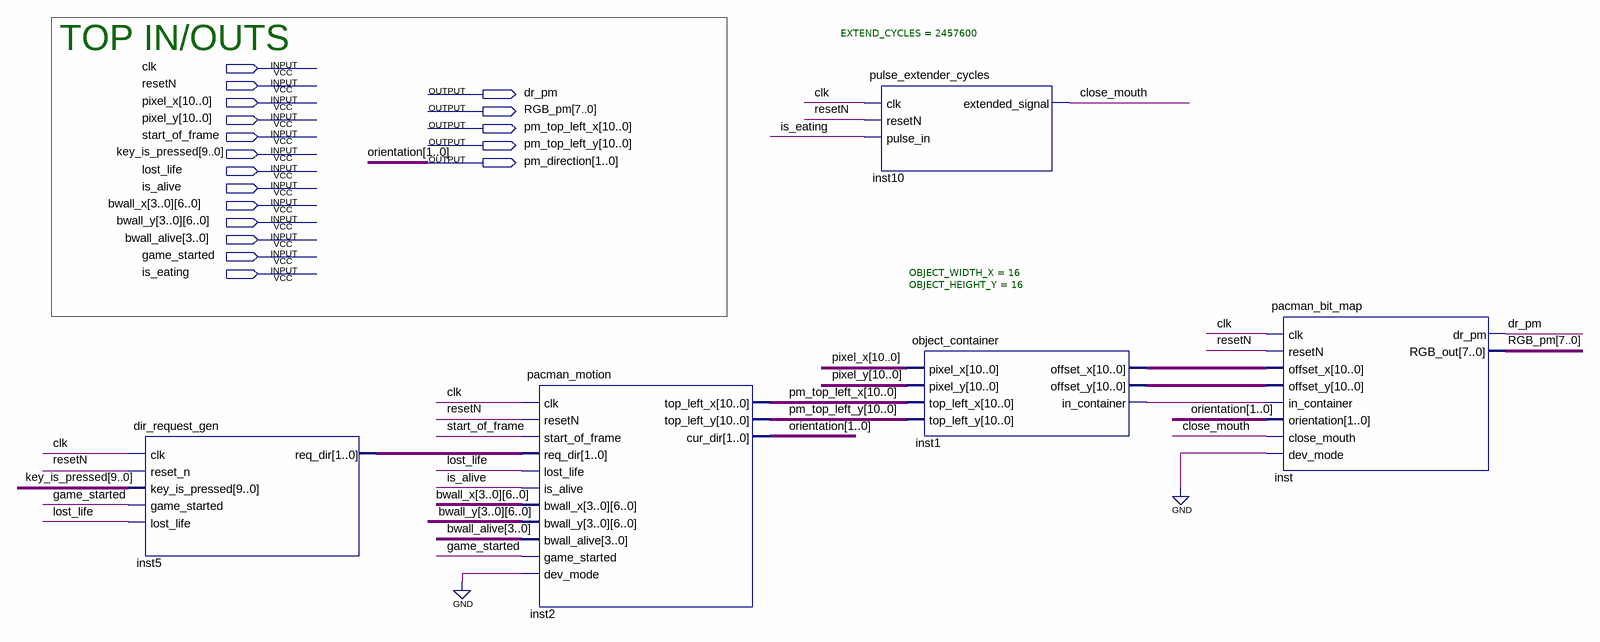
[diagram p0: schematic sheet]
// Quartus schematic TOP_PACMAN.bdf as structural Verilog: 5 symbols, 18 pins
module TOP_PACMAN (
  input  clk,
  input  resetN,
  input  [10:0] pixel_x,
  input  [10:0] pixel_y,
  input  start_of_frame,
  input  [9:0] key_is_pressed,
  input  lost_life,
  input  is_alive,
  input  [6:0] bwall_x_3,
  input  [6:0] bwall_x_2,
  input  [6:0] bwall_x_1,
  input  [6:0] bwall_x_0,
  input  [6:0] bwall_y_3,
  input  [6:0] bwall_y_2,
  input  [6:0] bwall_y_1,
  input  [6:0] bwall_y_0,
  input  [3:0] bwall_alive,
  input  game_started,
  input  is_eating,
  output dr_pm,
  output [7:0] RGB_pm,
  output [10:0] pm_top_left_x,
  output [10:0] pm_top_left_y,
  output [1:0] pm_direction
);

  wire close_mouth, inst1_in_container;
  wire [1:0] inst5_req_dir;
  wire [10:0] inst1_offset_x, inst1_offset_y;

  dir_request_gen inst5 (
    .clk(clk), .reset_n(resetN), .key_is_pressed(key_is_pressed), .game_started(game_started),
    .lost_life(lost_life), .req_dir(inst5_req_dir));
  pacman_motion inst2 (
    .clk(clk), .resetN(resetN), .start_of_frame(start_of_frame), .req_dir(inst5_req_dir),
    .lost_life(lost_life), .is_alive(is_alive), .bwall_x({bwall_x_3, bwall_x_2, bwall_x_1, bwall_x_0}),
    .bwall_y({bwall_y_3, bwall_y_2, bwall_y_1, bwall_y_0}), .bwall_alive(bwall_alive),
    .game_started(game_started), .dev_mode(1'b0), .top_left_x(pm_top_left_x), .top_left_y(pm_top_left_y),
    .cur_dir(pm_direction));
  pulse_extender_cycles #(.EXTEND_CYCLES(2457600)) inst10 (
    .clk(clk), .resetN(resetN), .pulse_in(is_eating), .extended_signal(close_mouth));
  object_container #(.OBJECT_WIDTH_X(16), .OBJECT_HEIGHT_Y(16)) inst1 (
    .pixel_x(pixel_x), .pixel_y(pixel_y), .top_left_x(pm_top_left_x), .top_left_y(pm_top_left_y),
    .offset_x(inst1_offset_x), .offset_y(inst1_offset_y), .in_container(inst1_in_container));
  pacman_bit_map inst (
    .clk(clk), .resetN(resetN), .offset_x(inst1_offset_x), .offset_y(inst1_offset_y),
    .in_container(inst1_in_container), .orientation(pm_direction), .close_mouth(close_mouth),
    .dev_mode(1'b0), .dr_pm(dr_pm), .RGB_out(RGB_pm));

  // Other names for the same wires on the sheet: orientation[1:0] = pm_direction

  // Notes on the sheet:
  //   TOP IN/OUTS
endmodule
